# EAGLE design moduloSensores (EAGLE 7.6.0)
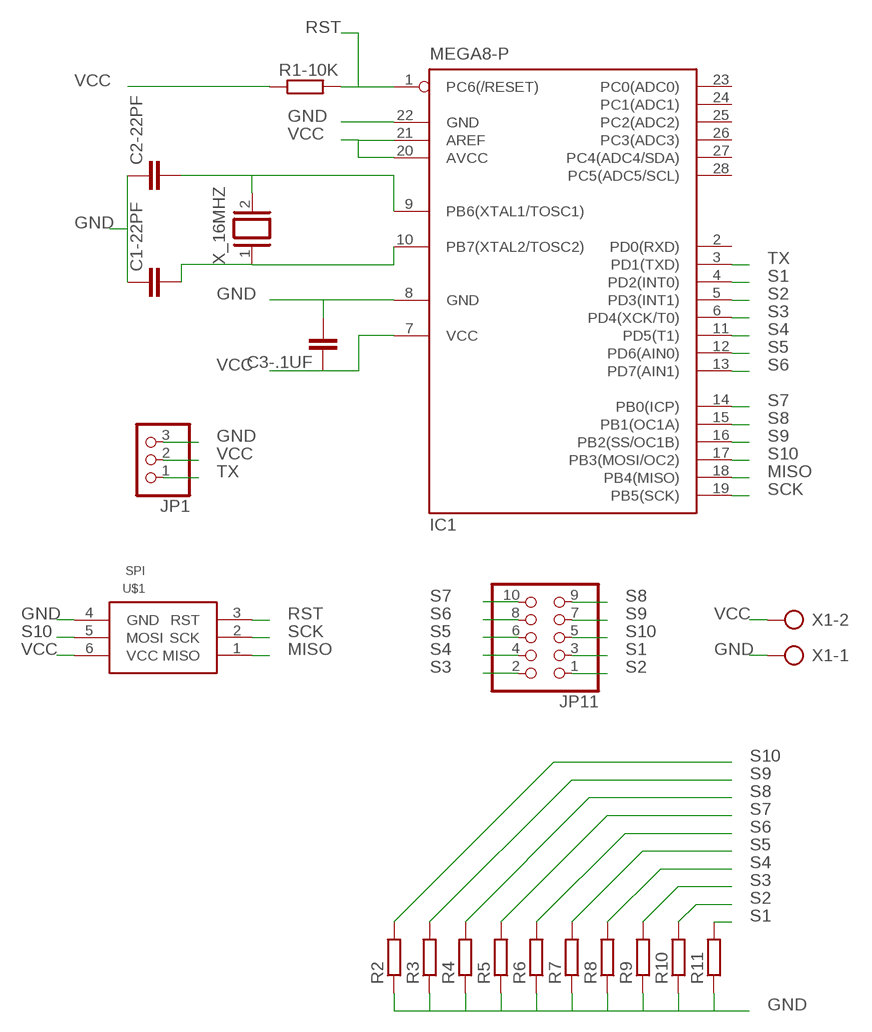
[diagram p0: schematic, sheet 1]

## Parts
C1-22PF  C-EU050-025X075  [C050-025X075]
C2-22PF  C-EU050-025X075  [C050-025X075]
C3-.1UF  C-EU050-025X075  [C050-025X075]
IC1  MEGA8-P  [DIL28-3]
JP1  PINHD-1X3  [1X03]
JP11  PINHD-2X5  [2X05]
R1-10K  R-EU_0204/7  [0204/7]
R2  R-EU_0204/7  [0204/7]
R3  R-EU_0204/7  [0204/7]
R4  R-EU_0204/7  [0204/7]
R5  R-EU_0204/7  [0204/7]
R6  R-EU_0204/7  [0204/7]
R7  R-EU_0204/7  [0204/7]
R8  R-EU_0204/7  [0204/7]
R9  R-EU_0204/7  [0204/7]
R10  R-EU_0204/7  [0204/7]
R11  R-EU_0204/7  [0204/7]
U$1  SPI  [HEAD-2X3]
X1  AK500/2  [AK500/2]
X_16MHZ  XTAL/S  [QS]

## Nets
GND: C1-22PF.1 C2-22PF.1 C3-.1UF.2 IC1.8(GND) IC1.22(GND) JP1.3 R2.1 R3.1 R4.1 R5.1 R6.1 R7.1 R8.1 R9.1 R10.1 R11.1 U$1.4(GND) X1.1
MISO: IC1.18(PB4(MISO)) U$1.1(MISO)
N$1: C2-22PF.2 IC1.9(PB6(XTAL1/TOSC1)) X_16MHZ.2
N$2: C1-22PF.2 IC1.10(PB7(XTAL2/TOSC2)) X_16MHZ.1
RST: IC1.1(PC6(/RESET)) R1-10K.2 U$1.3(RST)
S1: IC1.4(PD2(INT0)) JP11.3 R11.2
S2: IC1.5(PD3(INT1)) JP11.1 R10.2
S3: IC1.6(PD4(XCK/T0)) JP11.2 R9.2
S4: IC1.11(PD5(T1)) JP11.4 R8.2
S5: IC1.12(PD6(AIN0)) JP11.6 R7.2
S6: IC1.13(PD7(AIN1)) JP11.8 R6.2
S7: IC1.14(PB0(ICP)) JP11.10 R5.2
S8: IC1.15(PB1(OC1A)) JP11.9 R4.2
S9: IC1.16(PB2(SS/OC1B)) JP11.7 R3.2
S10: IC1.17(PB3(MOSI/OC2)) JP11.5 R2.2 U$1.5(MOSI)
SCK: IC1.19(PB5(SCK)) U$1.2(SCK)
TX: IC1.3(PD1(TXD)) JP1.1
VCC: C3-.1UF.1 IC1.7(VCC) IC1.20(AVCC) IC1.21(AREF) JP1.2 R1-10K.1 U$1.6(VCC) X1.2
Unconnected: IC1.2(PD0(RXD)) IC1.23(PC0(ADC0)) IC1.24(PC1(ADC1)) IC1.25(PC2(ADC2)) IC1.26(PC3(ADC3)) IC1.27(PC4(ADC4/SDA)) IC1.28(PC5(ADC5/SCL))

## Library data of the parts
C1-22PF C2-22PF C3-.1UF = rcl:C-EU: CAPACITOR, European symbol
IC1 = atmel:MEGA8-P: MICROCONTROLLER 8 Kbytes FLASH, 1 kbytes SRAM, 512 bytes EEPROM, USART, 4-channel 10 bit ADC, 2-channel 8 bit ADC Pin compatible with Atmega48, ATMega88, ATMega168 Source: avr.lbr; OC_FARNELL: unknown; OC_NEWARK: unknown
JP1 = pinhead:PINHD-1X3: PIN HEADER
JP11 = pinhead:PINHD-2X5: PIN HEADER
R1-10K R2-R11 = rcl:R-EU_: RESISTOR, European symbol
U$1 = spi:SPI
X1 = con-ptr500:AK500/2: CONNECTOR; OC_FARNELL: unknown; OC_NEWARK: unknown
X_16MHZ = special:XTAL/S: CRYSTAL

## Board
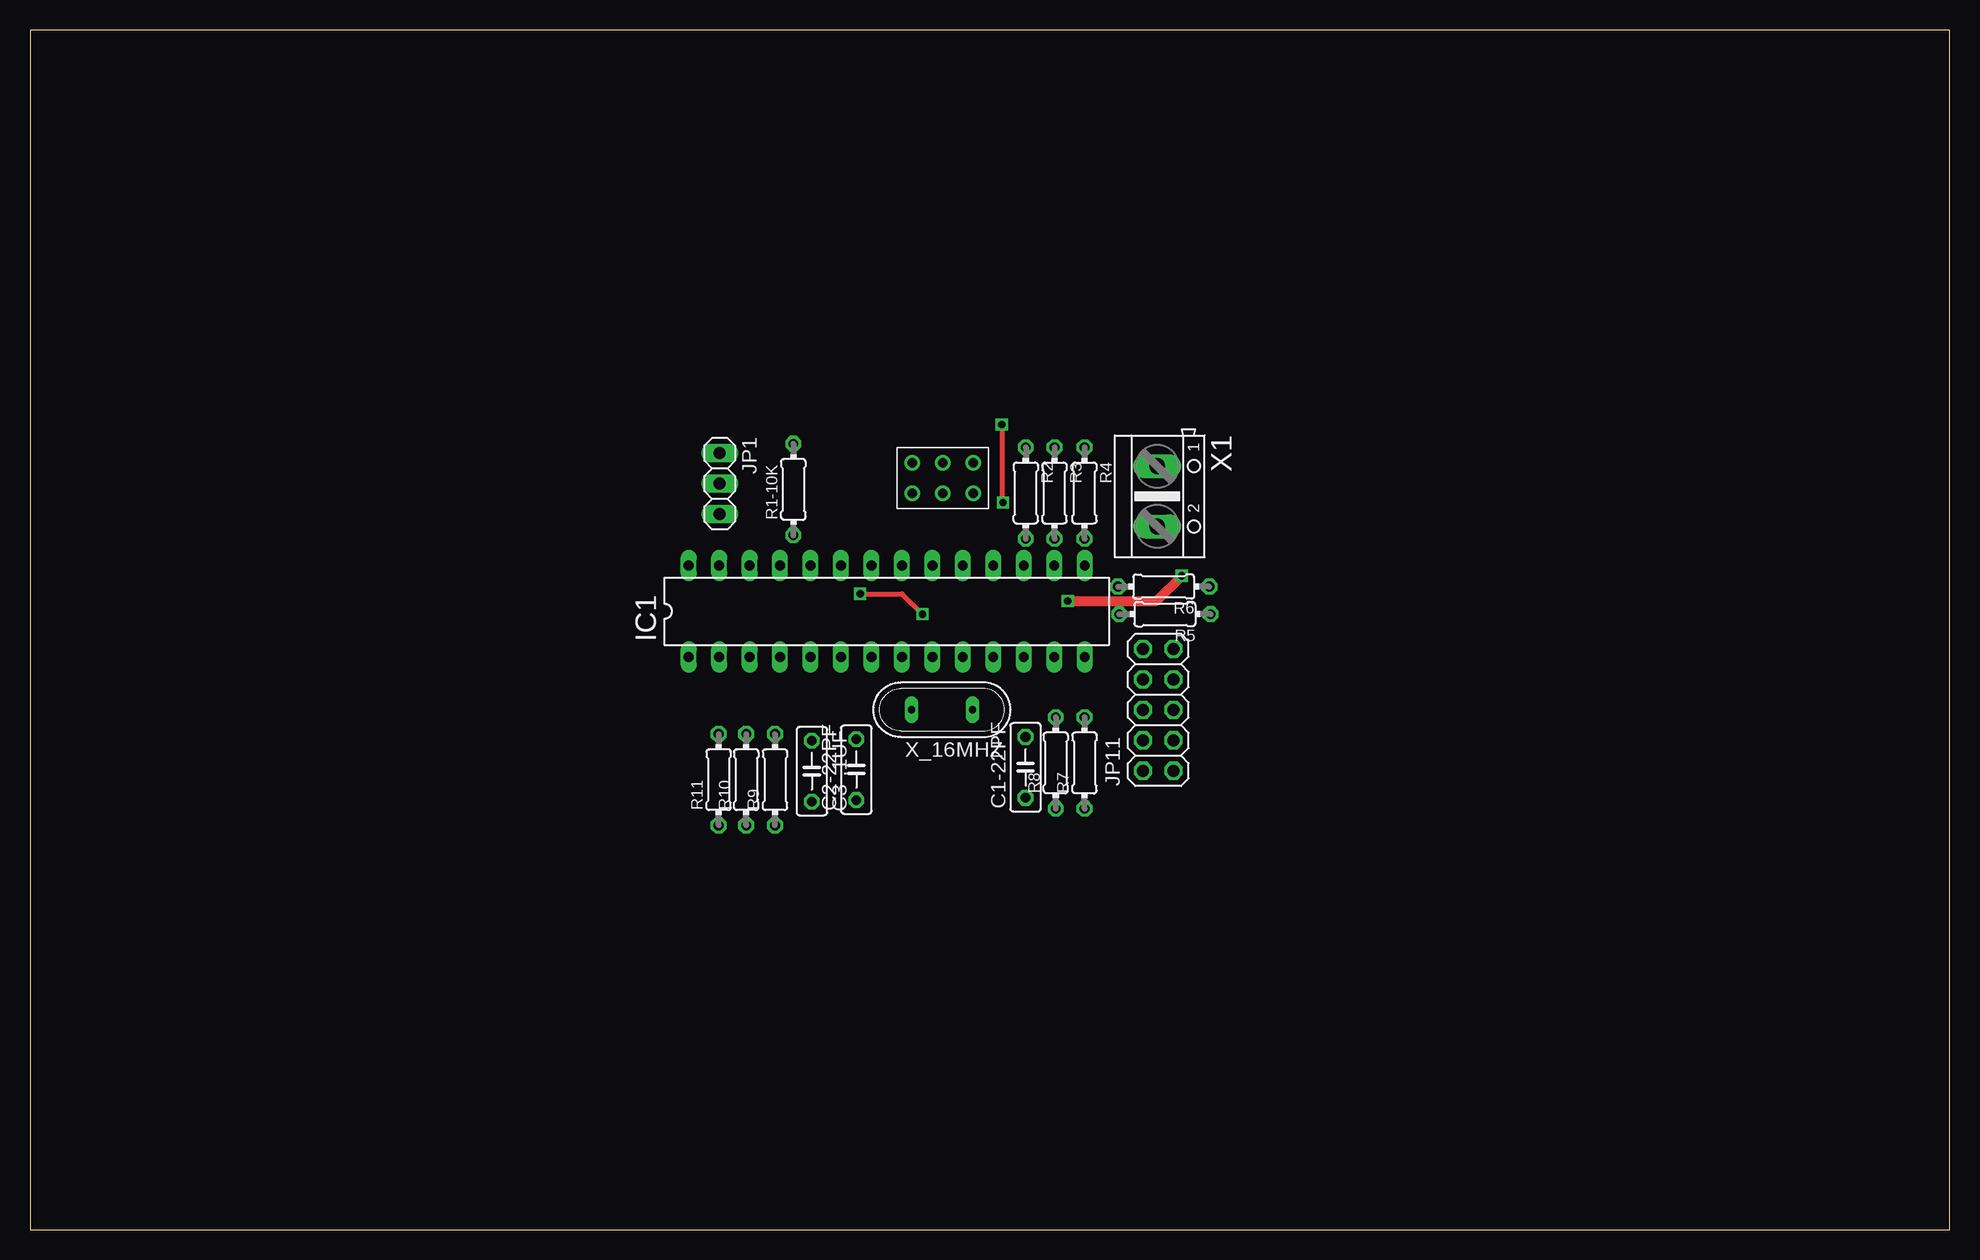
[diagram p1: board, top side]
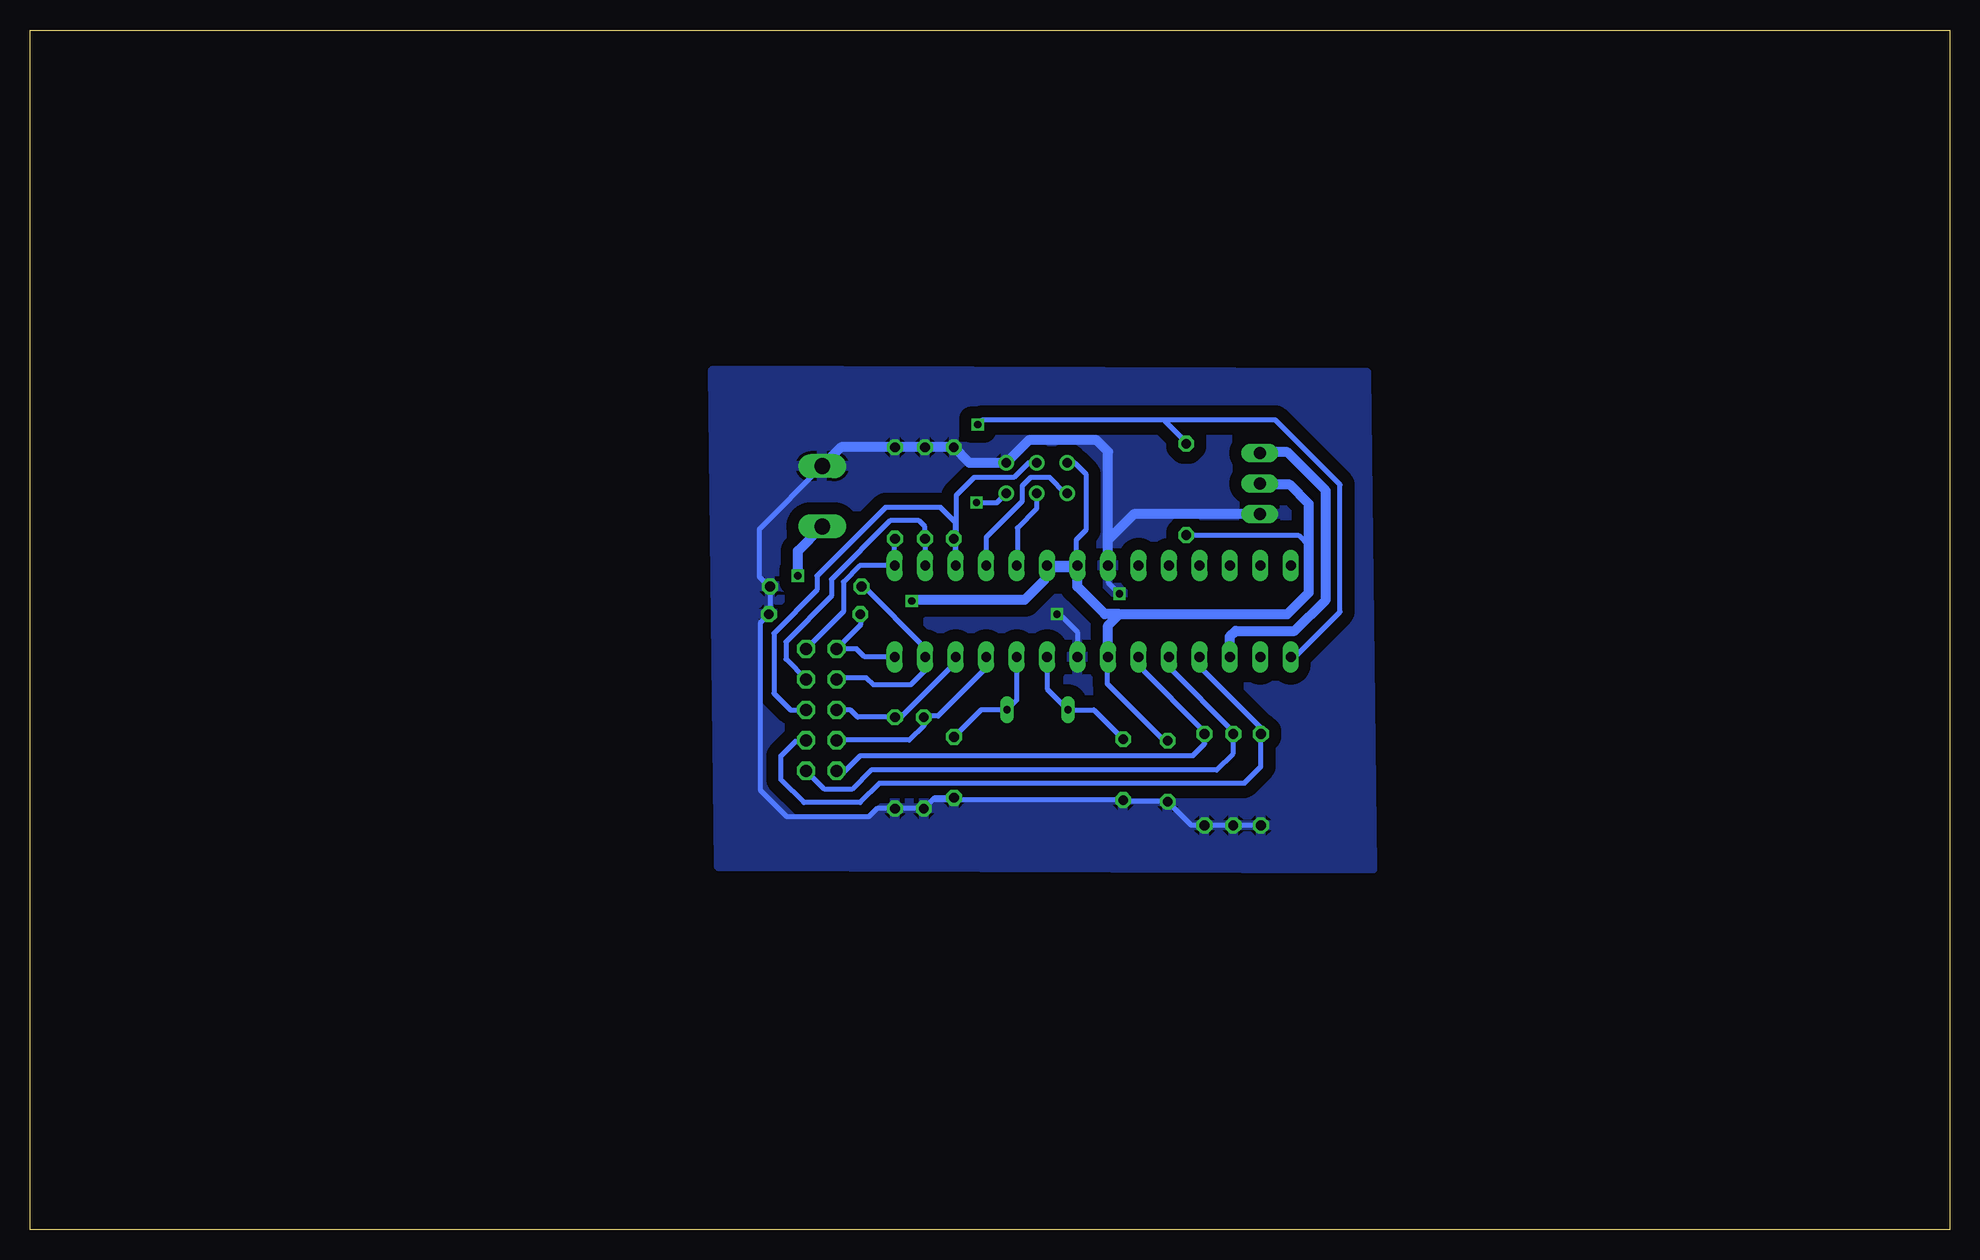
[diagram p2: board, bottom side, seen from below]

Size 160 x 100 mm. Coordinates in mm from the lower left corner, seen from the top.
Outline: 0,0 160,0 160,100 0,100 0,0
Copper layers (1*16): Top 0.035mm / dielectric 1.5mm / Bottom 0.035mm
Design rules "default": minimum track width 10mil, minimum drill 24mil, track to track 8mil, track to pad 8mil, pad to pad 8mil, via to via 8mil, smd to smd 8mil, copper to edge 40mil, drill to drill 8mil, minimum pad ring 10mil, minimum via ring 8mil, stop-mask expansion 4mil, vias tented up to drill 0mil, thermal gap 10mil

### Footprints (pad centres in the part's own frame; a part is rotated, then mirrored left to right if it is on the bottom)
C050-025X075 = drill 0.813 octagon: 1 -2.54,0; 2 2.54,0
DIL28-3 = drill 0.813 long: 1 -16.51,-3.81; 2 -13.97,-3.81; 3 -11.43,-3.81; 4 -8.89,-3.81; 5 -6.35,-3.81; 6 -3.81,-3.81; 7 -1.27,-3.81; 8 1.27,-3.81; 9 3.81,-3.81; 10 6.35,-3.81; 11 8.89,-3.81; 12 11.43,-3.81; 13 13.97,-3.81; 14 16.51,-3.81; 15 16.51,3.81; 16 13.97,3.81; 17 11.43,3.81; 18 8.89,3.81; 19 6.35,3.81; 20 3.81,3.81; 21 1.27,3.81; 22 -1.27,3.81; 23 -3.81,3.81; 24 -6.35,3.81; 25 -8.89,3.81; 26 -11.43,3.81; 27 -13.97,3.81; 28 -16.51,3.81
1X03 = drill 1.016 long: 1 -2.54,0; 2 0,0; 3 2.54,0
2X05 = drill 1.016 octagon: 1 -5.08,-1.27; 2 -5.08,1.27; 3 -2.54,-1.27; 4 -2.54,1.27; 5 0,-1.27; 6 0,1.27; 7 2.54,-1.27; 8 2.54,1.27; 9 5.08,-1.27; 10 5.08,1.27
0204/7 = drill 0.813 octagon: 1 -3.81,0; 2 3.81,0
HEAD-2X3 = drill 0.8: 1 -2.54,-1.27; 2 0,-1.27; 3 2.54,-1.27; 4 2.54,1.27; 5 0,1.27; 6 -2.54,1.27
AK500/2 = drill 1.321 long: 1 -2.515,0; 2 2.515,0
QS = drill 0.61 long: 1 -2.54,0; 2 2.54,0

### Placement (x,y rotation side)
C1-22PF  82.98,38.53 90 top
C2-22PF  68.88,38.34 90 top
C3-.1UF  65.17,38.21 270 top
IC1  71.41,51.54 0 top
JP1  57.49,62.18 270 top
JP11  94.04,43.32 90 top
R1-10K  63.63,61.7 90 top
R2  83,61.4 270 top
R3  85.4,61.4 270 top
R4  87.9,61.4 270 top
R5  94.6,51.3 180 top
R6  94.5,53.6 180 top
R7  87.9,38.9 90 top
R8  85.5,38.9 90 top
R9  62.1,37.5 90 top
R10  59.7,37.5 90 top
R11  57.4,37.5 90 top
U$1  76.09,62.64 0 top
X1  93.96,61.12 270 top
X_16MHZ  76.02,43.33 180 top

### Tracks (layer width: path | path; a pad name or v marks a point on that pad's centre or on a via)
GND  (via drill 0.6)
  Top 0.406: v69.2,53 72.7,53 v74.4,51.3
  Bottom 0.406: X1.1 99.2,58.4 99.2,54.4 98.4,53.6 R6.1 98.31,51.4 R5.1 99.1,50.61 99.1,36.6 96.9,34.4 90.1,34.4 89.4,35.1 R8.1 84.8,35.8 C2-22PF.1 | IC1.22 70.14,53.94 v69.2,53 | v74.4,51.3 74.2,51.3 72.7,49.8 72.7,47.75 IC1.8 | C2-22PF.1 68.75,35.67 C3-.1UF.2 63.19,33.69 R9.1 R10.1 R11.1 | C2-22PF.1 82.79,35.8 C1-22PF.1 84.6,35.99 R8.1 R7.1
  Bottom 0.813: IC1.22 70.14,57.5 | 70.14,57.5 70.14,64.84 71.1,65.8 76.74,65.8 U$1.4 81.7,63.91 R2.1 R3.1 R4.1 92.39,65.21 X1.1 | JP1.3 68,59.64 70.14,57.5
  pour Bottom (isolate 1.016): 48.6,71.4 103.1,71.6 102.6,30.3 48.1,30.1
MISO
  Bottom 0.406: U$1.1 73.67,61.37 75,62.7 76.6,62.7 77.3,62 77.3,60.7 80.3,57.7 IC1.18
N$1
  Bottom 0.406: IC1.9 75.22,45.07 X_16MHZ.2 71.33,43.33 C2-22PF.2
N$2
  Bottom 0.406: IC1.10 77.76,44.13 X_16MHZ.1 80.72,43.33 C1-22PF.2
RST  (via drill 0.6)
  Top 0.406: v81,67.1 81,60.7 v81.1,60.6
  Bottom 0.406: IC1.1 54.57,47.73 50.8,51.5 50.8,62.1 56.2,67.5 65.5,67.5 | 65.5,67.5 80.6,67.5 v81,67.1 | v81.1,60.6 79.4,60.6 U$1.3 | R1-10K.2 63.63,65.63 65.5,67.5
S1
  Bottom 0.406: JP11.3 95.39,40.7 96.2,40.7 97.4,39.5 97.4,37.5 95.5,35.6 90.8,35.6 89.2,37.2 58.8,37.2 57.4,38.6 R11.2 57.4,41.8 62.4,46.8 62.4,47.61 IC1.4
S2
  Bottom 0.406: JP11.1 93.77,36.7 91.5,36.7 89.9,38.3 61.1,38.3 59.7,39.7 R10.2 59.7,41.5 65,46.8 65,47.67 IC1.5
S3
  Bottom 0.406: JP11.2 92.73,38.2 92.1,38.2 90.8,39.5 63.1,39.5 62.1,40.5 R9.2 62.1,41.5 67.5,46.9 67.5,47.63 IC1.6
S4
  Bottom 0.406: IC1.11 80.3,46.8 84.3,42.8 85.41,42.8 R8.2 85.5,42 86.7,40.8 92.75,40.8 JP11.4
S5
  Bottom 0.406: IC1.12 82.84,47.26 87.3,42.8 87.81,42.8 R7.2 91.01,42.71 91.6,43.3 92.75,43.3 JP11.6
S6
  Bottom 0.406: JP11.8 92.63,46 90.3,46 89.7,45.4 86.6,45.4 85.38,46.62 IC1.13 85.4,47.75 85.4,48.5 90.5,53.6 R6.2
S7
  Bottom 0.406: IC1.14 90.43,47.73 91.1,48.4 JP11.10 90.79,50.38 R5.2
S8
  Bottom 0.406: R4.2 87.92,57.57 IC1.15 90.85,55.35 92.2,54 92.2,51.51 JP11.9
S9
  Bottom 0.406: IC1.16 85.4,55.37 R3.2 85.4,58.6 85.9,59.1 88.3,59.1 93.2,54.2 93.2,52.8 97,49 97,47.55 JP11.7
S10
  Bottom 0.406: U$1.5 76.79,63.91 78,62.7 81.3,62.7 82.8,61.2 82.8,57.39 | 82.8,57.39 82.8,55.39 IC1.17 82.84,58.94 84.1,60.2 88.7,60.2 94.4,54.5 94.4,53.3 98,49.7 98,44.7 96.6,43.3 95.33,43.3 JP11.5 | 82.8,57.39 R2.2
SCK
  Bottom 0.406: U$1.2 76.09,60.11 77.7,58.5 77.7,55.41 IC1.19
TX
  Bottom 0.813: IC1.3 59.98,49.42 59.5,49.9 54.6,49.9 52,52.5 52,61.6 55.2,64.8 57.41,64.8 JP1.1
VCC  (via drill 0.6)
  Top 0.813: v86.5,52.4 93.9,52.4 v96,54.5
  Bottom 0.406: C3-.1UF.1 65.45,40.75 70.2,45.5 70.2,47.67 IC1.7 | U$1.6 72.91,63.91 72,63 72,58.3 72.8,57.5 72.8,55.47 IC1.21 IC1.20 | R1-10K.1 54.29,57.89 53.4,57
  Bottom 0.813: 69.2,51.3 70.4,51.3 72.7,53.6 72.7,55.2 | 72.7,55.2 72.7,55.33 IC1.21 | IC1.7 70.14,50.36 69.2,51.3 | 69.2,51.3 55.2,51.3 53.4,53.1 53.4,57 53.4,60.5 55,62.1 57.41,62.1 JP1.2 | IC1.20 72.85,55.35 72.7,55.2 | 72.7,55.2 75.3,55.2 75.4,55.3 75.4,54.2 77.1,52.5 86.4,52.5 v86.5,52.4 | v96,54.5 96,56.56 X1.2